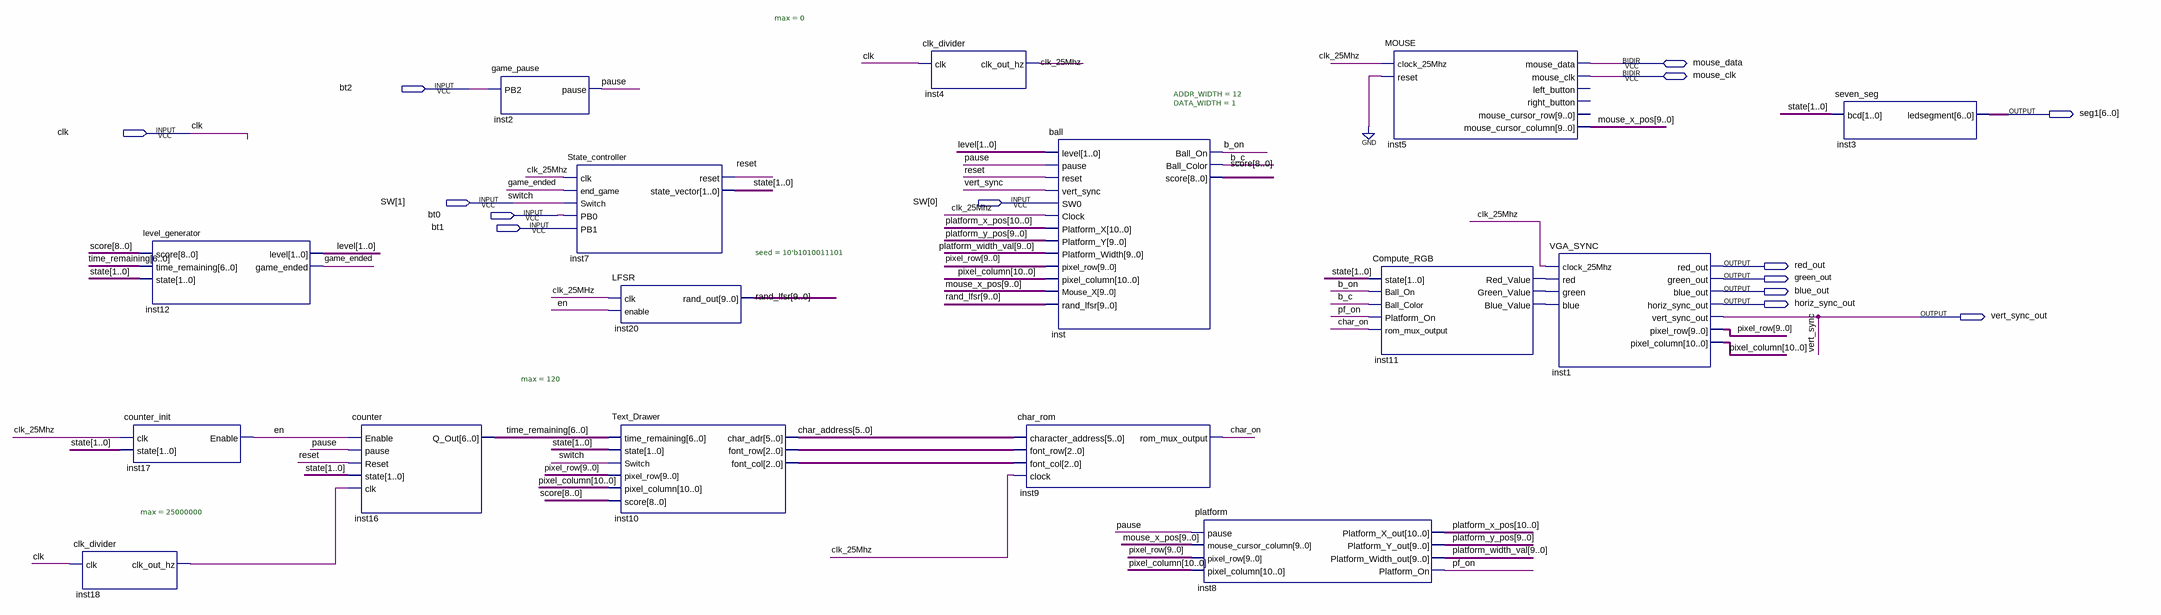
[diagram p0: schematic sheet]
// Quartus schematic 305game.bdf as structural Verilog: 16 symbols, 14 pins
module \305game  (
  input  bt2,
  input  clk,
  input  [1:0] SW,
  input  bt0,
  input  bt1,
  inout  mouse_data,
  inout  mouse_clk,
  output [6:0] seg1,
  output red_out,
  output green_out,
  output blue_out,
  output horiz_sync_out,
  output vert_sync_out
);

  wire b_c, b_on, char_on, clk_25Mhz, en, game_ended, inst11_blue_value, inst11_green_value,
       inst11_red_value, inst18_clk_out_hz, pause, pf_on, reset;
  wire [1:0] level, state;
  wire [2:0] inst10_font_col, inst10_font_row;
  wire [5:0] char_address;
  wire [6:0] time_remaining;
  wire [8:0] score;
  wire [9:0] mouse_x_pos, pixel_row, platform_width_val, platform_y_pos, rand_lfsr;
  wire [10:0] pixel_column, platform_x_pos;

  clk_divider #(.max(25000000)) inst18 (.clk(clk), .clk_out_hz(inst18_clk_out_hz));
  counter_init inst17 (.clk(clk_25Mhz), .state(state), .Enable(en));
  level_generator inst12 (
    .score(score), .time_remaining(time_remaining), .state(state), .level(level), .game_ended(game_ended));
  counter #(.max(120)) inst16 (
    .Enable(en), .pause(pause), .Reset(reset), .state(state), .clk(inst18_clk_out_hz), .Q_Out(time_remaining));
  game_pause inst2 (.PB2(bt2), .pause(pause));
  State_controller inst7 (
    .clk(clk_25Mhz), .end_game(game_ended), .Switch(SW[1]), .PB0(bt0), .PB1(bt1), .reset(reset),
    .state_vector(state));
  LFSR #(.seed(10'b1010011101)) inst20 (.clk(clk_25Mhz), .enable(en), .rand_out(rand_lfsr));
  Text_Drawer inst10 (
    .time_remaining(time_remaining), .state(state), .Switch(SW[1]), .pixel_row(pixel_row),
    .pixel_column(pixel_column), .score(score), .char_adr(char_address), .font_row(inst10_font_row),
    .font_col(inst10_font_col));
  clk_divider #(.max(0)) inst4 (.clk(clk), .clk_out_hz(clk_25Mhz));
  ball #(.ADDR_WIDTH(12), .DATA_WIDTH(1)) inst (
    .level(level), .pause(pause), .reset(reset), .vert_sync(vert_sync_out), .SW0(SW[0]), .Clock(clk_25Mhz),
    .Platform_X(platform_x_pos), .Platform_Y(platform_y_pos), .Platform_Width(platform_width_val),
    .pixel_row(pixel_row), .pixel_column(pixel_column), .Mouse_X(mouse_x_pos), .rand_lfsr(rand_lfsr),
    .Ball_On(b_on), .Ball_Color(b_c), .score(score));
  char_rom inst9 (
    .character_address(char_address), .font_row(inst10_font_row), .font_col(inst10_font_col),
    .clock(clk_25Mhz), .rom_mux_output(char_on));
  platform inst8 (
    .pause(pause), .mouse_cursor_column(mouse_x_pos), .pixel_row(pixel_row), .pixel_column(pixel_column),
    .Platform_X_out(platform_x_pos), .Platform_Y_out(platform_y_pos),
    .Platform_Width_out(platform_width_val), .Platform_On(pf_on));
  MOUSE inst5 (
    .clock_25Mhz(clk_25Mhz), .reset(1'b0), .mouse_cursor_column(mouse_x_pos), .mouse_data(mouse_data),
    .mouse_clk(mouse_clk));  // open: left_button, right_button, mouse_cursor_row
  Compute_RGB inst11 (
    .state(state), .Ball_On(b_on), .Ball_Color(b_c), .Platform_On(pf_on), .rom_mux_output(char_on),
    .Red_Value(inst11_red_value), .Green_Value(inst11_green_value), .Blue_Value(inst11_blue_value));
  VGA_SYNC inst1 (
    .clock_25Mhz(clk_25Mhz), .red(inst11_red_value), .green(inst11_green_value), .blue(inst11_blue_value),
    .red_out(red_out), .green_out(green_out), .blue_out(blue_out), .horiz_sync_out(horiz_sync_out),
    .vert_sync_out(vert_sync_out), .pixel_row(pixel_row), .pixel_column(pixel_column));
  seven_seg inst3 (.bcd(state), .ledsegment(seg1));

  // Other names for the same wires on the sheet: switch = SW[1]; vert_sync = vert_sync_out
endmodule
